# EAGLE design LED_Dimmer (EAGLE 9.4.2)
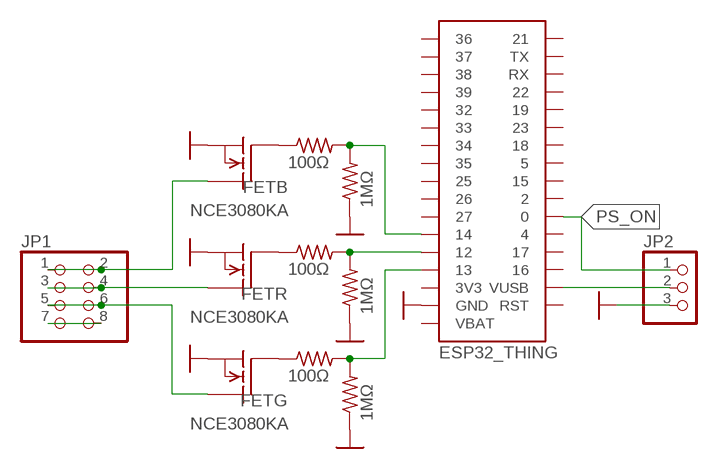
[diagram p0: schematic, sheet 1]

## Parts
FETB  NCE3080KA  [TO-252AA-2_1PRIMARY]
FETG  NCE3080KA  [TO-252AA-2_1PRIMARY]
FETR  NCE3080KA  [TO-252AA-2_1PRIMARY]
JP1  PINHD-2X4  [2X04]
JP2  PINHD-1X3/90  [1X03/90]
R1  100Ω  R-US_R0805  [R0805]
R2  100Ω  R-US_R0805  [R0805]
R3  100Ω  R-US_R0805  [R0805]
R4  1MΩ  R-US_R0805  [R0805]
R5  1MΩ  R-US_R0805  [R0805]
R6  1MΩ  R-US_R0805  [R0805]
U$1  ESP32_THING  [ESP32_THING]

## Nets
5V: JP2.2 U$1.P19(VUSB) U$1.P22(VUSB)
GND: FETB.3(S) FETG.3(S) FETR.3(S) JP2.3 R4.1 R5.1 R6.1 U$1.P17(GND) U$1.P20(GND) U$1.P21(GND) U$1.P24(GND) U$1.P40(GND)
N$1: FETG.1(G) R1.1
N$2: FETR.1(G) R2.1
N$3: FETB.1(G) R3.1
N$4: FETB.2(D) JP1.1 JP1.2
N$6: FETG.2(D) JP1.5 JP1.6
N$7: FETR.2(D) JP1.3 JP1.4
N$604: JP1.7 JP1.8
PS_ON: JP2.1 U$1.P29
PWM_B: R3.2 R6.2 U$1.P12
PWM_G: R1.2 R4.2 U$1.P14
PWM_R: R2.2 R5.2 U$1.P13
Unconnected: U$1.P1 U$1.P2 U$1.P3 U$1.P4 U$1.P5 U$1.P6 U$1.P7 U$1.P8 U$1.P9 U$1.P10 U$1.P11 U$1.P15(RST) U$1.P16(3V3) U$1.P18(VBAT) U$1.P23(VBAT) U$1.P25(3V3) U$1.P26 U$1.P27 U$1.P28 U$1.P30 U$1.P31 U$1.P32 U$1.P33 U$1.P34 U$1.P35 U$1.P36 U$1.P37(RX) U$1.P38(TX) U$1.P39

## Notes on the sheet
- NCE3080KA
- NCE3080KA
- NCE3080KA

## Library data of the parts
FETB FETG FETR = Personal:NCE3080KA
JP1 = pinhead:PINHD-2X4: PIN HEADER
JP2 = pinhead:PINHD-1X3: PIN HEADER
R1-R6 = rcl:R-US_: RESISTOR, American symbol; SPICEPREFIX: R
U$1 = Personal:ESP32_THING

## Board
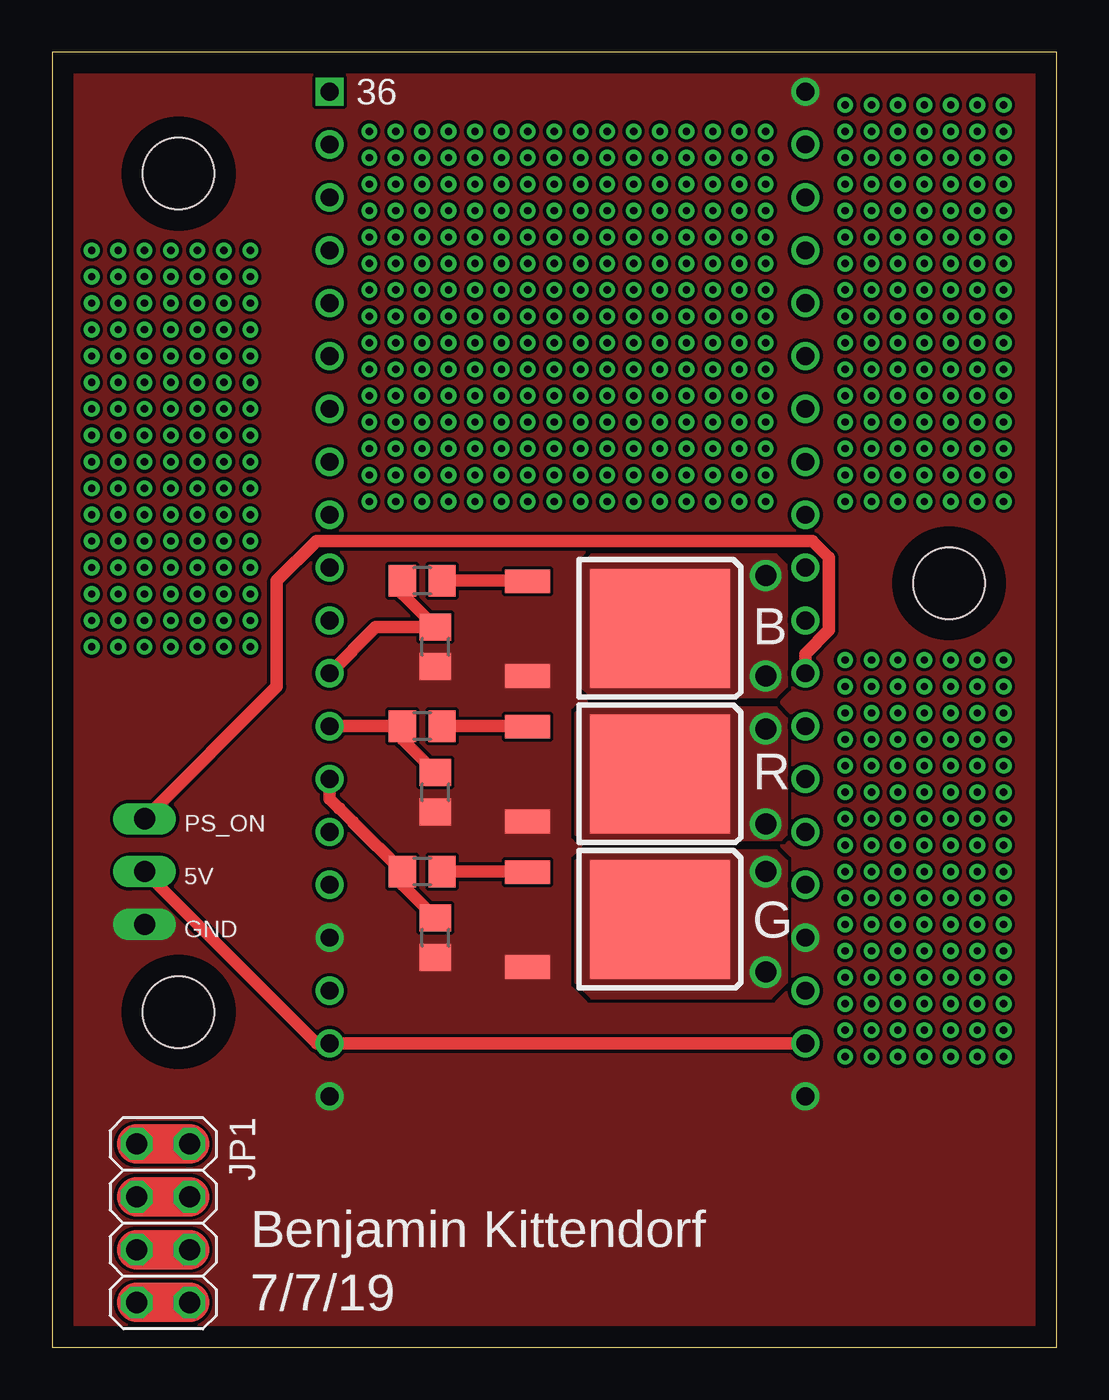
[diagram p1: board, top side]
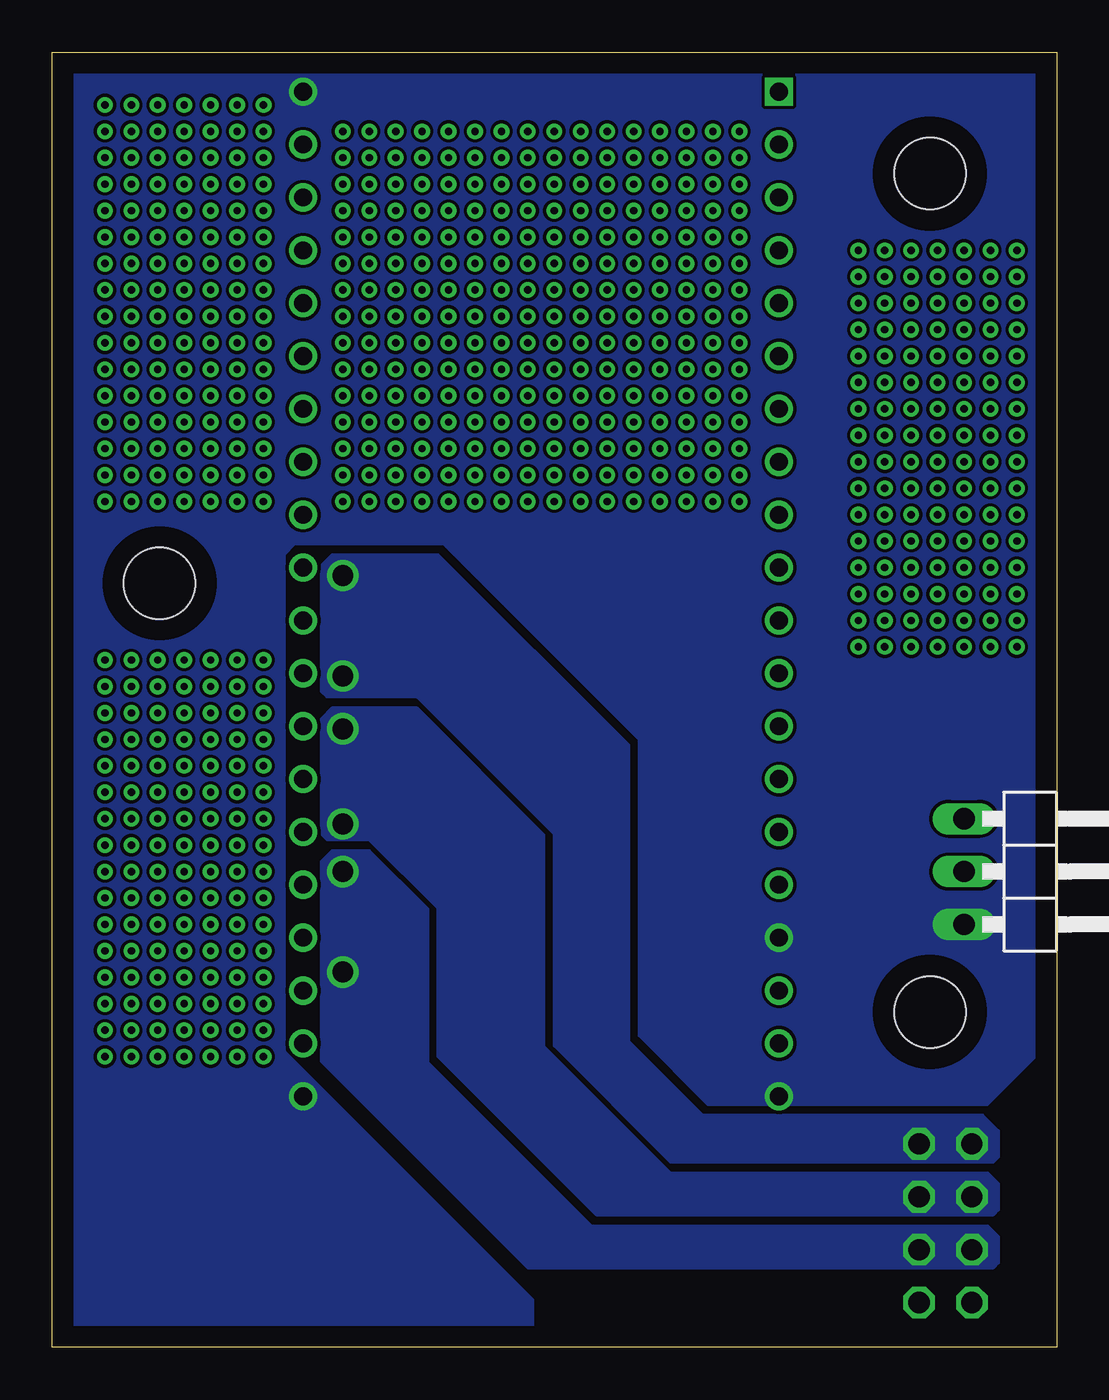
[diagram p2: board, bottom side, seen from below]

Size 48.26 x 62.23 mm. Coordinates in mm from the lower left corner, seen from the top.
Outline: 0,62.23 0,0 48.26,0 48.26,62.23 0,62.23
Copper layers (1*16): Top 0.035mm / dielectric 1.5mm / Bottom 0.035mm
Design rules "default": minimum track width 6mil, minimum drill 0.35mm, track to track 6mil, track to pad 6mil, pad to pad 6mil, via to via 6mil, smd to smd 6mil, copper to edge 40mil, drill to drill 6mil, minimum pad ring 10mil, minimum via ring 8mil, stop-mask expansion 4mil, vias tented up to drill 0mil, thermal gap 10mil
Holes 3.43 mm at 43.09,36.7 6.08,16.12 6.08,56.39

### Footprints (pad centres in the part's own frame; a part is rotated, then mirrored left to right if it is on the bottom)
TO-252AA-2_1PRIMARY = smd 1.143 x 2.159: 1 -0.025,0.025; 3 -4.572,0.025 | smd 5.715 x 6.731: 2 -2.286,-6.35
2X04 = drill 1.016 octagon: 1 -3.81,-1.27; 2 -3.81,1.27; 3 -1.27,-1.27; 4 -1.27,1.27; 5 1.27,-1.27; 6 1.27,1.27; 7 3.81,-1.27; 8 3.81,1.27
1X03/90 = drill 1.016 long: 1 -2.54,-3.81; 2 0,-3.81; 3 2.54,-3.81
R0805 = smd 1.3 x 1.5: 1 -0.95,0; 2 0.95,0
ESP32_THING = drill 0.85 square: P1 0,48.26 | drill 0.85: P2 0,45.72; P3 0,43.18; P4 0,40.64; P5 0,38.1; P6 0,35.56; P7 0,33.02; P8 0,30.48; P9 0,27.94; P10 0,25.4; P11 0,22.86; P12 0,20.32; P13 0,17.78; P14 0,15.24; P15 0,12.7; P16 0,10.16; P17 0,7.62; P18 0,5.08; P19 0,2.54; P20 0,0; P21 22.86,0; P22 22.86,2.54; P23 22.86,5.08; P24 22.86,7.62; P25 22.86,10.16; P26 22.86,12.7; P27 22.86,15.24; P28 22.86,17.78; P29 22.86,20.32; P30 22.86,22.86; P31 22.86,25.4; P32 22.86,27.94; P33 22.86,30.48; P34 22.86,33.02; P35 22.86,35.56; P36 22.86,38.1; P37 22.86,40.64; P38 22.86,43.18; P39 22.86,45.72; P40 22.86,48.26

### Placement (x,y rotation side)
FETB  22.86,36.83 90 top
FETG  22.86,22.86 90 top
FETR  22.86,29.84 90 top
JP1  5.33,5.97 270 top
JP2  0.64,22.86 270 bottom
R1  17.78,22.86 180 top
R2  17.78,29.84 180 top
R3  17.78,36.83 180 top
R4  18.41,19.69 90 top
R5  18.41,26.67 90 top
R6  18.41,33.66 90 top
U$1  13.34,12.07 0 top

### Tracks (layer width: path | path; a pad name or v marks a point on that pad's centre or on a via)
5V
  Top 0.61: JP2.2 12.7,14.61 U$1.P19 U$1.P22
GND
  pour Bottom (no thermals): 0,62.23 48.26,62.23 48.26,0.25 48.51,0 25.65,0 25.15,0.51 25.15,2.29 37.08,14.22 37.08,38.1 36.58,38.61 29.46,38.61 20.07,29.21 20.07,14.99 16.76,11.68 3.3,11.68 0,14.99
  pour Top (rank 2, no thermals): 0,62.23 48.51,62.23 48.51,-0.25 0.51,-0.25 0,0.25
N$1
  Top 0.61: R1.1 22.81,22.86 FETG.1
N$2
  Top 0.61: R2.1 22.81,29.84 FETR.1
N$3
  Top 0.61: R3.1 22.81,36.83 FETB.1
N$4  (via drill 1)
  Top 1.905: JP1.2 JP1.1
  other vias: 34.29,32.26 34.29,37.08
  pour Bottom (no thermals): 3.56,11.18 2.79,10.41 2.79,9.14 3.05,8.89 18.54,8.89 24.13,14.48 24.13,24.64 30.73,31.24 35.05,31.24 35.31,31.5 35.31,37.59 34.8,38.1 29.72,38.1 20.57,28.96 20.57,14.73 17.02,11.18
  pour Top (no thermals): 34.8,38.1 35.31,37.59 35.31,31.75 34.8,31.24 25.91,31.24 25.4,31.75 25.4,37.59 25.91,38.1
N$6  (via drill 1)
  Top 1.905: JP1.6 JP1.5
  other vias: 34.29,18.03 34.29,22.86
  pour Bottom (no thermals): 22.35,5.84 3.3,5.84 2.79,5.33 2.79,4.06 3.05,3.81 25.4,3.81 35.31,13.72 35.31,23.37 34.8,23.88 33.02,23.88 30.23,21.08 30.23,13.72
  pour Top (no thermals): 25.65,23.88 34.8,23.88 35.31,23.37 35.31,17.53 34.54,16.76 25.91,16.76 25.15,17.53 25.15,23.37
N$7  (via drill 1)
  Top 1.905: JP1.4 JP1.3
  other vias: 34.29,25.15 34.29,29.72
  pour Bottom (no thermals): 3.3,8.38 2.79,7.87 2.79,6.6 3.05,6.35 22.1,6.35 29.72,13.97 29.72,21.08 33.02,24.38 35.05,24.38 35.31,24.64 35.31,30.23 34.8,30.73 30.73,30.73 24.64,24.64 24.64,14.48 18.54,8.38
  pour Top (no thermals): 34.8,30.73 35.31,30.23 35.31,24.64 35.05,24.38 25.4,24.38 25.15,24.64 25.15,30.48 25.4,30.73
N$28  (via drill 0.35)
  other vias: 15.24,58.42
N$29  (via drill 0.35)
  other vias: 15.24,57.15
N$30  (via drill 0.35)
  other vias: 15.24,55.88
N$31  (via drill 0.35)
  other vias: 15.24,54.61
N$32  (via drill 0.35)
  other vias: 15.24,53.34
N$33  (via drill 0.35)
  other vias: 15.24,52.07
N$34  (via drill 0.35)
  other vias: 15.24,50.8
N$35  (via drill 0.35)
  other vias: 15.24,49.53
N$36  (via drill 0.35)
  other vias: 15.24,48.26
N$37  (via drill 0.35)
  other vias: 15.24,46.99
N$38  (via drill 0.35)
  other vias: 15.24,45.72
N$39  (via drill 0.35)
  other vias: 15.24,44.45
N$40  (via drill 0.35)
  other vias: 16.51,58.42
N$41  (via drill 0.35)
  other vias: 16.51,57.15
N$42  (via drill 0.35)
  other vias: 16.51,55.88
N$43  (via drill 0.35)
  other vias: 16.51,54.61
N$44  (via drill 0.35)
  other vias: 16.51,53.34
N$45  (via drill 0.35)
  other vias: 16.51,52.07
N$46  (via drill 0.35)
  other vias: 16.51,50.8
N$47  (via drill 0.35)
  other vias: 16.51,49.53
N$48  (via drill 0.35)
  other vias: 16.51,48.26
N$49  (via drill 0.35)
  other vias: 16.51,46.99
N$50  (via drill 0.35)
  other vias: 16.51,45.72
N$51  (via drill 0.35)
  other vias: 16.51,44.45
N$52  (via drill 0.35)
  other vias: 17.78,58.42
N$53  (via drill 0.35)
  other vias: 17.78,57.15
N$54  (via drill 0.35)
  other vias: 17.78,55.88
N$55  (via drill 0.35)
  other vias: 17.78,54.61
N$56  (via drill 0.35)
  other vias: 17.78,53.34
N$57  (via drill 0.35)
  other vias: 17.78,52.07
N$58  (via drill 0.35)
  other vias: 17.78,50.8
N$59  (via drill 0.35)
  other vias: 17.78,49.53
N$60  (via drill 0.35)
  other vias: 17.78,48.26
N$61  (via drill 0.35)
  other vias: 17.78,46.99
N$62  (via drill 0.35)
  other vias: 17.78,45.72
N$63  (via drill 0.35)
  other vias: 17.78,44.45
N$64  (via drill 0.35)
  other vias: 19.05,58.42
N$65  (via drill 0.35)
  other vias: 19.05,57.15
N$66  (via drill 0.35)
  other vias: 19.05,55.88
N$67  (via drill 0.35)
  other vias: 19.05,54.61
N$68  (via drill 0.35)
  other vias: 19.05,53.34
N$69  (via drill 0.35)
  other vias: 19.05,52.07
N$70  (via drill 0.35)
  other vias: 19.05,50.8
N$71  (via drill 0.35)
  other vias: 19.05,49.53
N$72  (via drill 0.35)
  other vias: 19.05,48.26
N$73  (via drill 0.35)
  other vias: 19.05,46.99
N$74  (via drill 0.35)
  other vias: 19.05,45.72
N$75  (via drill 0.35)
  other vias: 19.05,44.45
N$76  (via drill 0.35)
  other vias: 20.32,58.42
N$77  (via drill 0.35)
  other vias: 20.32,57.15
N$78  (via drill 0.35)
  other vias: 20.32,55.88
N$79  (via drill 0.35)
  other vias: 20.32,54.61
N$80  (via drill 0.35)
  other vias: 20.32,53.34
N$81  (via drill 0.35)
  other vias: 20.32,52.07
N$82  (via drill 0.35)
  other vias: 20.32,50.8
N$83  (via drill 0.35)
  other vias: 20.32,49.53
N$84  (via drill 0.35)
  other vias: 20.32,48.26
N$85  (via drill 0.35)
  other vias: 20.32,46.99
N$86  (via drill 0.35)
  other vias: 20.32,45.72
N$87  (via drill 0.35)
  other vias: 20.32,44.45
N$88  (via drill 0.35)
  other vias: 21.59,58.42
N$89  (via drill 0.35)
  other vias: 21.59,57.15
N$90  (via drill 0.35)
  other vias: 21.59,55.88
N$91  (via drill 0.35)
  other vias: 21.59,54.61
N$92  (via drill 0.35)
  other vias: 21.59,53.34
N$93  (via drill 0.35)
  other vias: 21.59,52.07
N$94  (via drill 0.35)
  other vias: 21.59,50.8
N$95  (via drill 0.35)
  other vias: 21.59,49.53
N$96  (via drill 0.35)
  other vias: 21.59,48.26
N$97  (via drill 0.35)
  other vias: 21.59,46.99
N$98  (via drill 0.35)
  other vias: 21.59,45.72
N$99  (via drill 0.35)
  other vias: 21.59,44.45
N$100  (via drill 0.35)
  other vias: 22.86,58.42
N$101  (via drill 0.35)
  other vias: 22.86,57.15
N$102  (via drill 0.35)
  other vias: 22.86,55.88
N$103  (via drill 0.35)
  other vias: 22.86,54.61
N$104  (via drill 0.35)
  other vias: 22.86,53.34
N$105  (via drill 0.35)
  other vias: 22.86,52.07
N$106  (via drill 0.35)
  other vias: 22.86,50.8
N$107  (via drill 0.35)
  other vias: 22.86,49.53
N$108  (via drill 0.35)
  other vias: 22.86,48.26
N$109  (via drill 0.35)
  other vias: 22.86,46.99
N$110  (via drill 0.35)
  other vias: 22.86,45.72
N$111  (via drill 0.35)
  other vias: 22.86,44.45
N$112  (via drill 0.35)
  other vias: 24.13,58.42
N$113  (via drill 0.35)
  other vias: 24.13,57.15
N$114  (via drill 0.35)
  other vias: 24.13,55.88
N$115  (via drill 0.35)
  other vias: 24.13,54.61
N$116  (via drill 0.35)
  other vias: 24.13,53.34
N$117  (via drill 0.35)
  other vias: 24.13,52.07
N$118  (via drill 0.35)
  other vias: 24.13,50.8
N$119  (via drill 0.35)
  other vias: 24.13,49.53
N$120  (via drill 0.35)
  other vias: 24.13,48.26
N$121  (via drill 0.35)
  other vias: 24.13,46.99
N$122  (via drill 0.35)
  other vias: 24.13,45.72
N$123  (via drill 0.35)
  other vias: 24.13,44.45
N$124  (via drill 0.35)
  other vias: 25.4,58.42
N$125  (via drill 0.35)
  other vias: 25.4,57.15
N$126  (via drill 0.35)
  other vias: 25.4,55.88
N$127  (via drill 0.35)
  other vias: 25.4,54.61
N$128  (via drill 0.35)
  other vias: 25.4,53.34
N$129  (via drill 0.35)
  other vias: 25.4,52.07
N$130  (via drill 0.35)
  other vias: 25.4,50.8
N$131  (via drill 0.35)
  other vias: 25.4,49.53
N$132  (via drill 0.35)
  other vias: 25.4,48.26
N$133  (via drill 0.35)
  other vias: 25.4,46.99
N$134  (via drill 0.35)
  other vias: 25.4,45.72
N$135  (via drill 0.35)
  other vias: 25.4,44.45
N$136  (via drill 0.35)
  other vias: 26.67,58.42
N$137  (via drill 0.35)
  other vias: 26.67,57.15
N$138  (via drill 0.35)
  other vias: 26.67,55.88
N$139  (via drill 0.35)
  other vias: 26.67,54.61
N$140  (via drill 0.35)
  other vias: 26.67,53.34
N$141  (via drill 0.35)
  other vias: 26.67,52.07
N$142  (via drill 0.35)
  other vias: 26.67,50.8
N$143  (via drill 0.35)
  other vias: 26.67,49.53
N$144  (via drill 0.35)
  other vias: 26.67,48.26
N$145  (via drill 0.35)
  other vias: 26.67,46.99
N$146  (via drill 0.35)
  other vias: 26.67,45.72
N$147  (via drill 0.35)
  other vias: 26.67,44.45
N$148  (via drill 0.35)
  other vias: 27.94,58.42
N$149  (via drill 0.35)
  other vias: 27.94,57.15
N$150  (via drill 0.35)
  other vias: 27.94,55.88
N$151  (via drill 0.35)
  other vias: 27.94,54.61
N$152  (via drill 0.35)
  other vias: 27.94,53.34
N$153  (via drill 0.35)
  other vias: 27.94,52.07
N$154  (via drill 0.35)
  other vias: 27.94,50.8
N$155  (via drill 0.35)
  other vias: 27.94,49.53
N$156  (via drill 0.35)
  other vias: 27.94,48.26
N$157  (via drill 0.35)
  other vias: 27.94,46.99
N$158  (via drill 0.35)
  other vias: 27.94,45.72
N$159  (via drill 0.35)
  other vias: 27.94,44.45
N$160  (via drill 0.35)
  other vias: 29.21,58.42
N$161  (via drill 0.35)
  other vias: 29.21,57.15
N$162  (via drill 0.35)
  other vias: 29.21,55.88
N$163  (via drill 0.35)
  other vias: 29.21,54.61
N$164  (via drill 0.35)
  other vias: 29.21,53.34
N$165  (via drill 0.35)
  other vias: 29.21,52.07
N$166  (via drill 0.35)
  other vias: 29.21,50.8
N$167  (via drill 0.35)
  other vias: 29.21,49.53
N$168  (via drill 0.35)
  other vias: 29.21,48.26
N$169  (via drill 0.35)
  other vias: 29.21,46.99
N$170  (via drill 0.35)
  other vias: 29.21,45.72
N$171  (via drill 0.35)
  other vias: 29.21,44.45
N$172  (via drill 0.35)
  other vias: 30.48,58.42
N$173  (via drill 0.35)
  other vias: 30.48,57.15
N$174  (via drill 0.35)
  other vias: 30.48,55.88
N$175  (via drill 0.35)
  other vias: 30.48,54.61
N$176  (via drill 0.35)
  other vias: 30.48,53.34
N$177  (via drill 0.35)
  other vias: 30.48,52.07
N$178  (via drill 0.35)
  other vias: 30.48,50.8
N$179  (via drill 0.35)
  other vias: 30.48,49.53
N$180  (via drill 0.35)
  other vias: 30.48,48.26
N$181  (via drill 0.35)
  other vias: 30.48,46.99
N$182  (via drill 0.35)
  other vias: 30.48,45.72
N$183  (via drill 0.35)
  other vias: 30.48,44.45
N$184  (via drill 0.35)
  other vias: 31.75,58.42
N$185  (via drill 0.35)
  other vias: 31.75,57.15
N$186  (via drill 0.35)
  other vias: 31.75,55.88
N$187  (via drill 0.35)
  other vias: 31.75,54.61
N$188  (via drill 0.35)
  other vias: 31.75,53.34
N$189  (via drill 0.35)
  other vias: 31.75,52.07
N$190  (via drill 0.35)
  other vias: 31.75,50.8
N$191  (via drill 0.35)
  other vias: 31.75,49.53
N$192  (via drill 0.35)
  other vias: 31.75,48.26
N$193  (via drill 0.35)
  other vias: 31.75,46.99
N$194  (via drill 0.35)
  other vias: 31.75,45.72
N$195  (via drill 0.35)
  other vias: 31.75,44.45
N$196  (via drill 0.35)
  other vias: 33.02,58.42
N$197  (via drill 0.35)
  other vias: 33.02,57.15
N$198  (via drill 0.35)
  other vias: 33.02,55.88
N$199  (via drill 0.35)
  other vias: 33.02,54.61
N$200  (via drill 0.35)
  other vias: 33.02,53.34
N$201  (via drill 0.35)
  other vias: 33.02,52.07
N$202  (via drill 0.35)
  other vias: 33.02,50.8
N$203  (via drill 0.35)
  other vias: 33.02,49.53
N$204  (via drill 0.35)
  other vias: 33.02,48.26
N$205  (via drill 0.35)
  other vias: 33.02,46.99
N$206  (via drill 0.35)
  other vias: 33.02,45.72
N$207  (via drill 0.35)
  other vias: 33.02,44.45
N$208  (via drill 0.35)
  other vias: 34.29,58.42
N$209  (via drill 0.35)
  other vias: 34.29,57.15
N$210  (via drill 0.35)
  other vias: 34.29,55.88
N$211  (via drill 0.35)
  other vias: 34.29,54.61
N$212  (via drill 0.35)
  other vias: 34.29,53.34
N$213  (via drill 0.35)
  other vias: 34.29,52.07
N$214  (via drill 0.35)
  other vias: 34.29,50.8
N$215  (via drill 0.35)
  other vias: 34.29,49.53
N$216  (via drill 0.35)
  other vias: 34.29,48.26
N$217  (via drill 0.35)
  other vias: 34.29,46.99
N$218  (via drill 0.35)
  other vias: 34.29,45.72
N$219  (via drill 0.35)
  other vias: 34.29,44.45
N$220  (via drill 0.35)
  other vias: 38.1,40.64
N$221  (via drill 0.35)
  other vias: 39.37,40.64
N$222  (via drill 0.35)
  other vias: 40.64,40.64
N$223  (via drill 0.35)
  other vias: 41.91,40.64
N$224  (via drill 0.35)
  other vias: 43.18,40.64
N$225  (via drill 0.35)
  other vias: 44.45,40.64
N$226  (via drill 0.35)
  other vias: 45.72,40.64
N$227  (via drill 0.35)
  other vias: 38.1,41.91
N$228  (via drill 0.35)
  other vias: 39.37,41.91
N$229  (via drill 0.35)
  other vias: 40.64,41.91
N$230  (via drill 0.35)
  other vias: 41.91,41.91
N$231  (via drill 0.35)
  other vias: 43.18,41.91
N$232  (via drill 0.35)
  other vias: 44.45,41.91
N$233  (via drill 0.35)
  other vias: 45.72,41.91
N$234  (via drill 0.35)
  other vias: 38.1,43.18
N$235  (via drill 0.35)
  other vias: 39.37,43.18
N$236  (via drill 0.35)
  other vias: 40.64,43.18
N$237  (via drill 0.35)
  other vias: 41.91,43.18
N$238  (via drill 0.35)
  other vias: 43.18,43.18
N$239  (via drill 0.35)
  other vias: 44.45,43.18
N$240  (via drill 0.35)
  other vias: 45.72,43.18
N$241  (via drill 0.35)
  other vias: 38.1,44.45
N$242  (via drill 0.35)
  other vias: 39.37,44.45
N$243  (via drill 0.35)
  other vias: 40.64,44.45
N$244  (via drill 0.35)
  other vias: 41.91,44.45
N$245  (via drill 0.35)
  other vias: 43.18,44.45
N$246  (via drill 0.35)
  other vias: 44.45,44.45
N$247  (via drill 0.35)
  other vias: 45.72,44.45
N$248  (via drill 0.35)
  other vias: 38.1,45.72
N$249  (via drill 0.35)
  other vias: 39.37,45.72
N$250  (via drill 0.35)
  other vias: 40.64,45.72
N$251  (via drill 0.35)
  other vias: 41.91,45.72
N$252  (via drill 0.35)
  other vias: 43.18,45.72
N$253  (via drill 0.35)
  other vias: 44.45,45.72
N$254  (via drill 0.35)
  other vias: 45.72,45.72
N$255  (via drill 0.35)
  other vias: 38.1,46.99
N$256  (via drill 0.35)
  other vias: 39.37,46.99
N$257  (via drill 0.35)
  other vias: 40.64,46.99
N$258  (via drill 0.35)
  other vias: 41.91,46.99
N$259  (via drill 0.35)
  other vias: 43.18,46.99
N$260  (via drill 0.35)
  other vias: 44.45,46.99
N$261  (via drill 0.35)
  other vias: 45.72,46.99
N$262  (via drill 0.35)
  other vias: 38.1,48.26
N$263  (via drill 0.35)
  other vias: 39.37,48.26
N$264  (via drill 0.35)
  other vias: 40.64,48.26
N$265  (via drill 0.35)
  other vias: 41.91,48.26
N$266  (via drill 0.35)
  other vias: 43.18,48.26
N$267  (via drill 0.35)
  other vias: 44.45,48.26
N$268  (via drill 0.35)
  other vias: 45.72,48.26
N$269  (via drill 0.35)
  other vias: 38.1,49.53
N$270  (via drill 0.35)
  other vias: 39.37,49.53
N$271  (via drill 0.35)
  other vias: 40.64,49.53
N$272  (via drill 0.35)
  other vias: 41.91,49.53
N$273  (via drill 0.35)
  other vias: 43.18,49.53
N$274  (via drill 0.35)
  other vias: 44.45,49.53
N$275  (via drill 0.35)
  other vias: 45.72,49.53
N$276  (via drill 0.35)
  other vias: 38.1,50.8
N$277  (via drill 0.35)
  other vias: 39.37,50.8
N$278  (via drill 0.35)
  other vias: 40.64,50.8
N$279  (via drill 0.35)
  other vias: 41.91,50.8
N$280  (via drill 0.35)
  other vias: 43.18,50.8
N$281  (via drill 0.35)
  other vias: 44.45,50.8
N$282  (via drill 0.35)
  other vias: 45.72,50.8
N$283  (via drill 0.35)
  other vias: 38.1,52.07
N$284  (via drill 0.35)
  other vias: 39.37,52.07
N$285  (via drill 0.35)
  other vias: 40.64,52.07
N$286  (via drill 0.35)
  other vias: 41.91,52.07
N$287  (via drill 0.35)
  other vias: 43.18,52.07
N$288  (via drill 0.35)
  other vias: 44.45,52.07
N$289  (via drill 0.35)
  other vias: 45.72,52.07
N$290  (via drill 0.35)
  other vias: 38.1,53.34
N$291  (via drill 0.35)
  other vias: 39.37,53.34
N$292  (via drill 0.35)
  other vias: 40.64,53.34
N$293  (via drill 0.35)
  other vias: 41.91,53.34
N$294  (via drill 0.35)
  other vias: 43.18,53.34
N$295  (via drill 0.35)
  other vias: 44.45,53.34
N$296  (via drill 0.35)
  other vias: 45.72,53.34
N$297  (via drill 0.35)
  other vias: 38.1,54.61
N$298  (via drill 0.35)
  other vias: 39.37,54.61
N$299  (via drill 0.35)
  other vias: 40.64,54.61
N$300  (via drill 0.35)
  other vias: 41.91,54.61
N$301  (via drill 0.35)
  other vias: 43.18,54.61
N$302  (via drill 0.35)
  other vias: 44.45,54.61
N$303  (via drill 0.35)
  other vias: 45.72,54.61
N$304  (via drill 0.35)
  other vias: 38.1,55.88
N$305  (via drill 0.35)
  other vias: 39.37,55.88
N$306  (via drill 0.35)
  other vias: 40.64,55.88
N$307  (via drill 0.35)
  other vias: 41.91,55.88
N$308  (via drill 0.35)
  other vias: 43.18,55.88
N$309  (via drill 0.35)
  other vias: 44.45,55.88
N$310  (via drill 0.35)
  other vias: 45.72,55.88
N$311  (via drill 0.35)
  other vias: 38.1,57.15
N$312  (via drill 0.35)
  other vias: 39.37,57.15
N$313  (via drill 0.35)
  other vias: 40.64,57.15
N$314  (via drill 0.35)
  other vias: 41.91,57.15
N$315  (via drill 0.35)
  other vias: 43.18,57.15
N$316  (via drill 0.35)
  other vias: 44.45,57.15
N$317  (via drill 0.35)
  other vias: 45.72,57.15
N$318  (via drill 0.35)
  other vias: 38.1,58.42
N$319  (via drill 0.35)
  other vias: 39.37,58.42
N$320  (via drill 0.35)
  other vias: 40.64,58.42
N$321  (via drill 0.35)
  other vias: 41.91,58.42
N$322  (via drill 0.35)
  other vias: 43.18,58.42
N$323  (via drill 0.35)
  other vias: 44.45,58.42
N$324  (via drill 0.35)
  other vias: 45.72,58.42
N$325  (via drill 0.35)
  other vias: 38.1,59.69
N$326  (via drill 0.35)
  other vias: 39.37,59.69
N$327  (via drill 0.35)
  other vias: 40.64,59.69
N$328  (via drill 0.35)
  other vias: 41.91,59.69
N$329  (via drill 0.35)
  other vias: 43.18,59.69
N$330  (via drill 0.35)
  other vias: 44.45,59.69
N$331  (via drill 0.35)
  other vias: 45.72,59.69
N$332  (via drill 0.35)
  other vias: 1.91,33.66
N$333  (via drill 0.35)
  other vias: 3.17,33.66
N$334  (via drill 0.35)
  other vias: 4.45,33.66
N$335  (via drill 0.35)
  other vias: 5.71,33.66
N$336  (via drill 0.35)
  other vias: 6.99,33.66
N$337  (via drill 0.35)
  other vias: 8.26,33.66
N$338  (via drill 0.35)
  other vias: 9.53,33.66
N$339  (via drill 0.35)
  other vias: 1.91,34.92
N$340  (via drill 0.35)
  other vias: 3.17,34.92
N$341  (via drill 0.35)
  other vias: 4.45,34.92
N$342  (via drill 0.35)
  other vias: 5.71,34.92
N$343  (via drill 0.35)
  other vias: 6.99,34.92
N$344  (via drill 0.35)
  other vias: 8.26,34.92
N$345  (via drill 0.35)
  other vias: 9.53,34.92
N$346  (via drill 0.35)
  other vias: 1.91,36.2
N$347  (via drill 0.35)
  other vias: 3.17,36.2
N$348  (via drill 0.35)
  other vias: 4.45,36.2
N$349  (via drill 0.35)
  other vias: 5.71,36.2
N$350  (via drill 0.35)
  other vias: 6.99,36.2
N$351  (via drill 0.35)
  other vias: 8.26,36.2
N$352  (via drill 0.35)
  other vias: 9.53,36.2
N$353  (via drill 0.35)
  other vias: 1.91,37.47
N$354  (via drill 0.35)
  other vias: 3.17,37.47
N$355  (via drill 0.35)
  other vias: 4.45,37.47
N$356  (via drill 0.35)
  other vias: 5.71,37.47
N$357  (via drill 0.35)
  other vias: 6.99,37.47
N$358  (via drill 0.35)
  other vias: 8.26,37.47
N$359  (via drill 0.35)
  other vias: 9.53,37.47
N$360  (via drill 0.35)
  other vias: 1.91,38.73
N$361  (via drill 0.35)
  other vias: 3.17,38.73
N$362  (via drill 0.35)
  other vias: 4.45,38.73
N$363  (via drill 0.35)
  other vias: 5.71,38.73
N$364  (via drill 0.35)
  other vias: 6.99,38.73
N$365  (via drill 0.35)
  other vias: 8.26,38.73
N$366  (via drill 0.35)
  other vias: 9.53,38.73
N$367  (via drill 0.35)
  other vias: 1.91,40
N$368  (via drill 0.35)
  other vias: 3.17,40
N$369  (via drill 0.35)
  other vias: 4.45,40
N$370  (via drill 0.35)
  other vias: 5.71,40
N$371  (via drill 0.35)
  other vias: 6.99,40
N$372  (via drill 0.35)
  other vias: 8.26,40
N$373  (via drill 0.35)
  other vias: 9.53,40
N$374  (via drill 0.35)
  other vias: 1.91,41.27
N$375  (via drill 0.35)
  other vias: 3.17,41.27
N$376  (via drill 0.35)
  other vias: 4.45,41.27
N$377  (via drill 0.35)
  other vias: 5.71,41.27
N$378  (via drill 0.35)
  other vias: 6.99,41.27
N$379  (via drill 0.35)
  other vias: 8.26,41.27
N$380  (via drill 0.35)
  other vias: 9.53,41.27
N$381  (via drill 0.35)
  other vias: 1.91,42.55
N$382  (via drill 0.35)
  other vias: 3.17,42.55
N$383  (via drill 0.35)
  other vias: 4.45,42.55
N$384  (via drill 0.35)
  other vias: 5.71,42.55
N$385  (via drill 0.35)
  other vias: 6.99,42.55
N$386  (via drill 0.35)
  other vias: 8.26,42.55
N$387  (via drill 0.35)
  other vias: 9.53,42.55
N$388  (via drill 0.35)
  other vias: 1.91,43.81
N$389  (via drill 0.35)
  other vias: 3.17,43.81
N$390  (via drill 0.35)
  other vias: 4.45,43.81
N$391  (via drill 0.35)
  other vias: 5.71,43.81
N$392  (via drill 0.35)
  other vias: 6.99,43.81
N$393  (via drill 0.35)
  other vias: 8.26,43.81
N$394  (via drill 0.35)
  other vias: 9.53,43.81
N$395  (via drill 0.35)
  other vias: 1.91,45.09
N$396  (via drill 0.35)
  other vias: 3.17,45.09
N$397  (via drill 0.35)
  other vias: 4.45,45.09
N$398  (via drill 0.35)
  other vias: 5.71,45.09
N$399  (via drill 0.35)
  other vias: 6.99,45.09
N$400  (via drill 0.35)
  other vias: 8.26,45.09
N$401  (via drill 0.35)
  other vias: 9.53,45.09
N$402  (via drill 0.35)
  other vias: 1.91,46.36
N$403  (via drill 0.35)
  other vias: 3.17,46.36
N$404  (via drill 0.35)
  other vias: 4.45,46.36
N$405  (via drill 0.35)
  other vias: 5.71,46.36
N$406  (via drill 0.35)
  other vias: 6.99,46.36
N$407  (via drill 0.35)
  other vias: 8.26,46.36
N$408  (via drill 0.35)
  other vias: 9.53,46.36
N$409  (via drill 0.35)
  other vias: 1.91,47.62
N$410  (via drill 0.35)
  other vias: 3.17,47.62
N$411  (via drill 0.35)
  other vias: 4.45,47.62
N$412  (via drill 0.35)
  other vias: 5.71,47.62
N$413  (via drill 0.35)
  other vias: 6.99,47.62
N$414  (via drill 0.35)
  other vias: 8.26,47.62
N$415  (via drill 0.35)
  other vias: 9.53,47.62
N$416  (via drill 0.35)
  other vias: 1.91,48.9
N$417  (via drill 0.35)
  other vias: 3.17,48.9
N$418  (via drill 0.35)
  other vias: 4.45,48.9
N$419  (via drill 0.35)
  other vias: 5.71,48.9
N$420  (via drill 0.35)
  other vias: 6.99,48.9
N$421  (via drill 0.35)
  other vias: 8.26,48.9
N$422  (via drill 0.35)
  other vias: 9.53,48.9
N$423  (via drill 0.35)
  other vias: 1.91,50.16
N$424  (via drill 0.35)
  other vias: 3.17,50.16
N$425  (via drill 0.35)
  other vias: 4.45,50.16
N$426  (via drill 0.35)
  other vias: 5.71,50.16
N$427  (via drill 0.35)
  other vias: 6.99,50.16
N$428  (via drill 0.35)
  other vias: 8.26,50.16
N$429  (via drill 0.35)
  other vias: 9.53,50.16
N$430  (via drill 0.35)
  other vias: 1.91,51.44
N$431  (via drill 0.35)
  other vias: 3.17,51.44
N$432  (via drill 0.35)
  other vias: 4.45,51.44
N$433  (via drill 0.35)
  other vias: 5.71,51.44
N$434  (via drill 0.35)
  other vias: 6.99,51.44
N$435  (via drill 0.35)
  other vias: 8.26,51.44
N$436  (via drill 0.35)
  other vias: 9.53,51.44
N$437  (via drill 0.35)
  other vias: 1.91,52.7
N$438  (via drill 0.35)
  other vias: 3.17,52.7
N$439  (via drill 0.35)
  other vias: 4.45,52.7
N$440  (via drill 0.35)
  other vias: 5.71,52.7
N$441  (via drill 0.35)
  other vias: 6.99,52.7
N$442  (via drill 0.35)
  other vias: 8.26,52.7
N$443  (via drill 0.35)
  other vias: 9.53,52.7
N$444  (via drill 0.35)
  other vias: 38.1,13.97
N$445  (via drill 0.35)
  other vias: 39.37,13.97
N$446  (via drill 0.35)
  other vias: 40.64,13.97
N$447  (via drill 0.35)
  other vias: 41.91,13.97
N$448  (via drill 0.35)
  other vias: 43.18,13.97
N$449  (via drill 0.35)
  other vias: 44.45,13.97
N$450  (via drill 0.35)
  other vias: 45.72,13.97
N$451  (via drill 0.35)
  other vias: 38.1,15.24
N$452  (via drill 0.35)
  other vias: 39.37,15.24
N$453  (via drill 0.35)
  other vias: 40.64,15.24
N$454  (via drill 0.35)
  other vias: 41.91,15.24
N$455  (via drill 0.35)
  other vias: 43.18,15.24
N$456  (via drill 0.35)
  other vias: 44.45,15.24
N$457  (via drill 0.35)
  other vias: 45.72,15.24
N$458  (via drill 0.35)
  other vias: 38.1,16.51
N$459  (via drill 0.35)
  other vias: 39.37,16.51
N$460  (via drill 0.35)
  other vias: 40.64,16.51
N$461  (via drill 0.35)
  other vias: 41.91,16.51
N$462  (via drill 0.35)
  other vias: 43.18,16.51
N$463  (via drill 0.35)
  other vias: 44.45,16.51
N$464  (via drill 0.35)
  other vias: 45.72,16.51
N$465  (via drill 0.35)
  other vias: 38.1,17.78
N$466  (via drill 0.35)
  other vias: 39.37,17.78
N$467  (via drill 0.35)
  other vias: 40.64,17.78
N$468  (via drill 0.35)
  other vias: 41.91,17.78
N$469  (via drill 0.35)
  other vias: 43.18,17.78
N$470  (via drill 0.35)
  other vias: 44.45,17.78
N$471  (via drill 0.35)
  other vias: 45.72,17.78
N$472  (via drill 0.35)
  other vias: 38.1,19.05
N$473  (via drill 0.35)
  other vias: 39.37,19.05
N$474  (via drill 0.35)
  other vias: 40.64,19.05
N$475  (via drill 0.35)
  other vias: 41.91,19.05
N$476  (via drill 0.35)
  other vias: 43.18,19.05
N$477  (via drill 0.35)
  other vias: 44.45,19.05
N$478  (via drill 0.35)
  other vias: 45.72,19.05
N$479  (via drill 0.35)
  other vias: 38.1,20.32
N$480  (via drill 0.35)
  other vias: 39.37,20.32
N$481  (via drill 0.35)
  other vias: 40.64,20.32
N$482  (via drill 0.35)
  other vias: 41.91,20.32
N$483  (via drill 0.35)
  other vias: 43.18,20.32
N$484  (via drill 0.35)
  other vias: 44.45,20.32
N$485  (via drill 0.35)
  other vias: 45.72,20.32
N$486  (via drill 0.35)
  other vias: 38.1,21.59
N$487  (via drill 0.35)
  other vias: 39.37,21.59
N$488  (via drill 0.35)
  other vias: 40.64,21.59
N$489  (via drill 0.35)
  other vias: 41.91,21.59
N$490  (via drill 0.35)
  other vias: 43.18,21.59
N$491  (via drill 0.35)
  other vias: 44.45,21.59
N$492  (via drill 0.35)
  other vias: 45.72,21.59
N$493  (via drill 0.35)
  other vias: 38.1,22.86
N$494  (via drill 0.35)
  other vias: 39.37,22.86
N$495  (via drill 0.35)
  other vias: 40.64,22.86
N$496  (via drill 0.35)
  other vias: 41.91,22.86
N$497  (via drill 0.35)
  other vias: 43.18,22.86
N$498  (via drill 0.35)
  other vias: 44.45,22.86
N$499  (via drill 0.35)
  other vias: 45.72,22.86
N$500  (via drill 0.35)
  other vias: 38.1,24.13
N$501  (via drill 0.35)
  other vias: 39.37,24.13
N$502  (via drill 0.35)
  other vias: 40.64,24.13
N$503  (via drill 0.35)
  other vias: 41.91,24.13
N$504  (via drill 0.35)
  other vias: 43.18,24.13
N$505  (via drill 0.35)
  other vias: 44.45,24.13
N$506  (via drill 0.35)
  other vias: 45.72,24.13
N$507  (via drill 0.35)
  other vias: 38.1,25.4
N$508  (via drill 0.35)
  other vias: 39.37,25.4
N$509  (via drill 0.35)
  other vias: 40.64,25.4
N$510  (via drill 0.35)
  other vias: 41.91,25.4
N$511  (via drill 0.35)
  other vias: 43.18,25.4
N$512  (via drill 0.35)
  other vias: 44.45,25.4
N$513  (via drill 0.35)
  other vias: 45.72,25.4
N$514  (via drill 0.35)
  other vias: 38.1,26.67
N$515  (via drill 0.35)
  other vias: 39.37,26.67
N$516  (via drill 0.35)
  other vias: 40.64,26.67
N$517  (via drill 0.35)
  other vias: 41.91,26.67
N$518  (via drill 0.35)
  other vias: 43.18,26.67
N$519  (via drill 0.35)
  other vias: 44.45,26.67
N$520  (via drill 0.35)
  other vias: 45.72,26.67
N$521  (via drill 0.35)
  other vias: 38.1,27.94
N$522  (via drill 0.35)
  other vias: 39.37,27.94
N$523  (via drill 0.35)
  other vias: 40.64,27.94
N$524  (via drill 0.35)
  other vias: 41.91,27.94
N$525  (via drill 0.35)
  other vias: 43.18,27.94
N$526  (via drill 0.35)
  other vias: 44.45,27.94
N$527  (via drill 0.35)
  other vias: 45.72,27.94
N$528  (via drill 0.35)
  other vias: 38.1,29.21
N$529  (via drill 0.35)
  other vias: 39.37,29.21
N$530  (via drill 0.35)
  other vias: 40.64,29.21
N$531  (via drill 0.35)
  other vias: 41.91,29.21
N$532  (via drill 0.35)
  other vias: 43.18,29.21
N$533  (via drill 0.35)
  other vias: 44.45,29.21
N$534  (via drill 0.35)
  other vias: 45.72,29.21
N$535  (via drill 0.35)
  other vias: 38.1,30.48
N$536  (via drill 0.35)
  other vias: 39.37,30.48
N$537  (via drill 0.35)
  other vias: 40.64,30.48
N$538  (via drill 0.35)
  other vias: 41.91,30.48
N$539  (via drill 0.35)
  other vias: 43.18,30.48
N$540  (via drill 0.35)
  other vias: 44.45,30.48
N$541  (via drill 0.35)
  other vias: 45.72,30.48
N$542  (via drill 0.35)
  other vias: 38.1,31.75
N$543  (via drill 0.35)
  other vias: 39.37,31.75
N$544  (via drill 0.35)
  other vias: 40.64,31.75
N$545  (via drill 0.35)
  other vias: 41.91,31.75
N$546  (via drill 0.35)
  other vias: 43.18,31.75
N$547  (via drill 0.35)
  other vias: 44.45,31.75
N$548  (via drill 0.35)
  other vias: 45.72,31.75
N$549  (via drill 0.35)
  other vias: 38.1,33.02
N$550  (via drill 0.35)
  other vias: 39.37,33.02
N$551  (via drill 0.35)
  other vias: 40.64,33.02
N$552  (via drill 0.35)
  other vias: 41.91,33.02
N$553  (via drill 0.35)
  other vias: 43.18,33.02
N$554  (via drill 0.35)
  other vias: 44.45,33.02
N$555  (via drill 0.35)
  other vias: 45.72,33.02
N$556  (via drill 0.35)
  other vias: 15.24,43.18
N$557  (via drill 0.35)
  other vias: 15.24,41.91
N$558  (via drill 0.35)
  other vias: 15.24,40.64
N$559  (via drill 0.35)
  other vias: 16.51,43.18
N$560  (via drill 0.35)
  other vias: 16.51,41.91
N$561  (via drill 0.35)
  other vias: 16.51,40.64
N$562  (via drill 0.35)
  other vias: 17.78,43.18
N$563  (via drill 0.35)
  other vias: 17.78,41.91
N$564  (via drill 0.35)
  other vias: 17.78,40.64
N$565  (via drill 0.35)
  other vias: 19.05,43.18
N$566  (via drill 0.35)
  other vias: 19.05,41.91
N$567  (via drill 0.35)
  other vias: 19.05,40.64
N$568  (via drill 0.35)
  other vias: 20.32,43.18
N$569  (via drill 0.35)
  other vias: 20.32,41.91
N$570  (via drill 0.35)
  other vias: 20.32,40.64
N$571  (via drill 0.35)
  other vias: 21.59,43.18
N$572  (via drill 0.35)
  other vias: 21.59,41.91
N$573  (via drill 0.35)
  other vias: 21.59,40.64
N$574  (via drill 0.35)
  other vias: 22.86,43.18
N$575  (via drill 0.35)
  other vias: 22.86,41.91
N$576  (via drill 0.35)
  other vias: 22.86,40.64
N$577  (via drill 0.35)
  other vias: 24.13,43.18
N$578  (via drill 0.35)
  other vias: 24.13,41.91
N$579  (via drill 0.35)
  other vias: 24.13,40.64
N$580  (via drill 0.35)
  other vias: 25.4,43.18
N$581  (via drill 0.35)
  other vias: 25.4,41.91
N$582  (via drill 0.35)
  other vias: 25.4,40.64
N$583  (via drill 0.35)
  other vias: 26.67,43.18
N$584  (via drill 0.35)
  other vias: 26.67,41.91
N$585  (via drill 0.35)
  other vias: 26.67,40.64
N$586  (via drill 0.35)
  other vias: 27.94,43.18
N$587  (via drill 0.35)
  other vias: 27.94,41.91
N$588  (via drill 0.35)
  other vias: 27.94,40.64
N$589  (via drill 0.35)
  other vias: 29.21,43.18
N$590  (via drill 0.35)
  other vias: 29.21,41.91
N$591  (via drill 0.35)
  other vias: 29.21,40.64
N$592  (via drill 0.35)
  other vias: 30.48,43.18
N$593  (via drill 0.35)
  other vias: 30.48,41.91
N$594  (via drill 0.35)
  other vias: 30.48,40.64
N$595  (via drill 0.35)
  other vias: 31.75,43.18
N$596  (via drill 0.35)
  other vias: 31.75,41.91
N$597  (via drill 0.35)
  other vias: 31.75,40.64
N$598  (via drill 0.35)
  other vias: 33.02,43.18
N$599  (via drill 0.35)
  other vias: 33.02,41.91
N$600  (via drill 0.35)
  other vias: 33.02,40.64
N$601  (via drill 0.35)
  other vias: 34.29,43.18
N$602  (via drill 0.35)
  other vias: 34.29,41.91
N$603  (via drill 0.35)
  other vias: 34.29,40.64
N$604
  Top 1.905: JP1.8 JP1.7
PS_ON
  Top 0.61: JP2.1 10.79,31.75 10.79,36.83 12.7,38.73 36.53,38.73 37.33,37.94 37.33,34.45 36.2,33.32 U$1.P29
PWM_B
  Top 0.61: R3.2 16.83,36.19 R6.2 15.55,34.61 U$1.P12
PWM_G
  Top 0.61: R4.2 16.83,22.22 R1.2 14.47,25.22 14.47,25.24 13.81,25.9 13.79,25.9 13.34,26.36 U$1.P14
PWM_R
  Top 0.61: R5.2 16.83,29.21 R2.2 U$1.P13

### Text on the board
tPlace: B | R | PS_ON | 5V | GND | G | Benjamin Kittendorf | 7/7/19